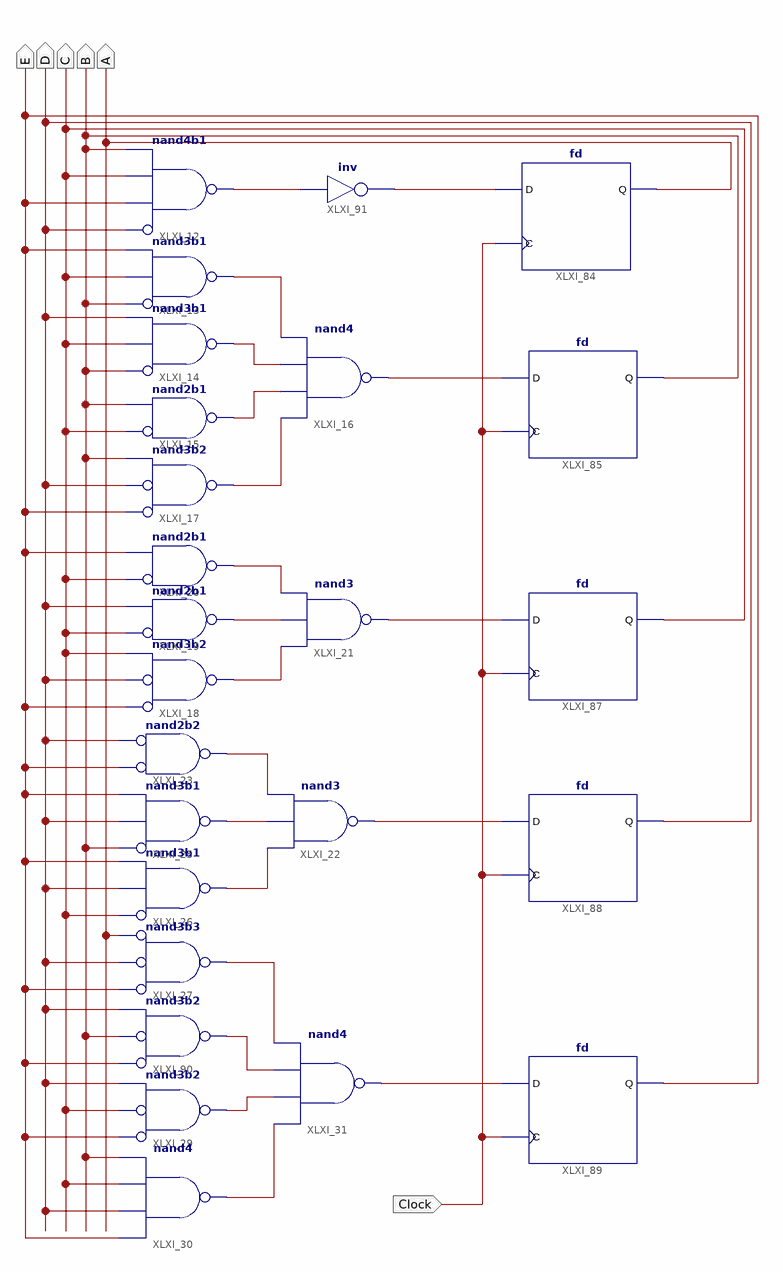
[diagram p0: schematic sheet 1]
// Xilinx ISE schematic Main.sch (artix7) as structural Verilog: 25 symbols, 6 ports
module Main (
  input  Clock,
  output D,
  output C,
  output B,
  output A,
  output E
);

  wire XLXN_19, XLXN_20, XLXN_21, XLXN_22, XLXN_23, XLXN_24, XLXN_25, XLXN_26, XLXN_27, XLXN_28, XLXN_29,
       XLXN_30, XLXN_32, XLXN_33, XLXN_35, XLXN_36, XLXN_37, XLXN_38, XLXN_39, XLXN_85;

  nand XLXI_13 (XLXN_20, ~B, C, E);  // nand3b1
  nand XLXI_14 (XLXN_21, ~B, C, D);  // nand3b1
  nand XLXI_15 (XLXN_22, ~C, B);  // nand2b1
  nand XLXI_16 (XLXN_24, XLXN_23, XLXN_22, XLXN_21, XLXN_20);
  nand XLXI_17 (XLXN_23, ~E, ~D, B);  // nand3b2
  nand XLXI_12 (XLXN_19, ~D, E, C, B);  // nand4b1
  nand XLXI_20 (XLXN_26, ~C, E);  // nand2b1
  nand XLXI_21 (XLXN_25, XLXN_28, XLXN_27, XLXN_26);
  nand XLXI_18 (XLXN_28, ~E, ~D, C);  // nand3b2
  nand XLXI_23 (XLXN_29, ~E, ~D);  // nand2b2
  nand XLXI_26 (XLXN_32, ~C, D, E);  // nand3b1
  nand XLXI_22 (XLXN_33, XLXN_32, XLXN_30, XLXN_29);
  nand XLXI_29 (XLXN_37, ~E, ~C, D);  // nand3b2
  nand XLXI_27 (XLXN_35, ~E, ~D, ~A);  // nand3b3
  nand XLXI_31 (XLXN_39, XLXN_38, XLXN_37, XLXN_36, XLXN_35);
  fd XLXI_87 (.C(Clock), .D(XLXN_25), .Q(C));
  fd XLXI_85 (.C(Clock), .D(XLXN_24), .Q(B));
  fd XLXI_84 (.C(Clock), .D(XLXN_85), .Q(A));
  fd XLXI_88 (.C(Clock), .D(XLXN_33), .Q(D));
  nand XLXI_19 (XLXN_27, ~C, D);  // nand2b1
  nand XLXI_25 (XLXN_30, ~B, D, E);  // nand3b1
  nand XLXI_90 (XLXN_36, ~E, ~B, D);  // nand3b2
  fd XLXI_89 (.C(Clock), .D(XLXN_39), .Q(E));
  nand XLXI_30 (XLXN_38, E, D, C, B);
  not XLXI_91 (XLXN_85, XLXN_19);
endmodule
